# Altium schematic sheet Power Input.SchDoc
size A
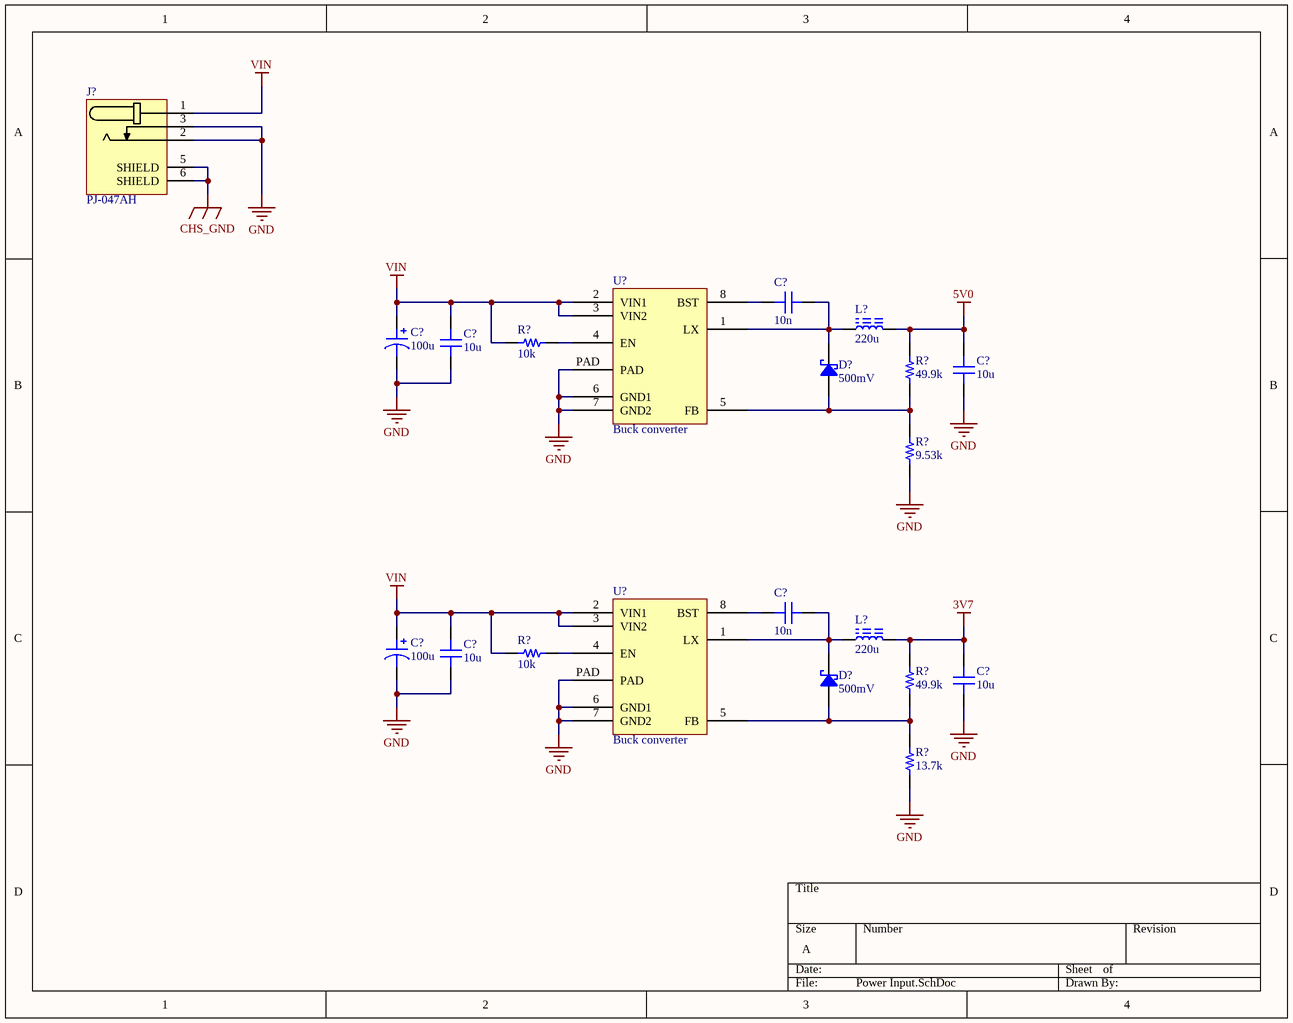
[diagram p0: Power Input.SchDoc]

## Parts
(Parts that share a designator on the sheet are numbered #1, #2 ... from top to bottom, then left to right.)
C?#1  10n  [C0603]
C?#2  100u  [C8x11.5x3.5]
C?#3  10u  [C1206]
C?#4  10u  [C0805]
C?#5  10n  [C0603]
C?#6  100u  [C8x11.5x3.5]
C?#7  10u  [C1206]
C?#8  10u  [C0805]
D?#1  500mV  [SOD-123]
D?#2  500mV  [SOD-123]
J?  PJ-047AH  [PJ-047AH]
L?#1  220u  [L1210]
L?#2  220u  [L1210]
R?#1  10k  [R0201]
R?#2  49.9k  [R0603]
R?#3  9.53k  [R0603]
R?#4  10k  [R0201]
R?#5  49.9k  [R0603]
R?#6  13.7k  [R0603]
U?#1  Buck converter  [AOZ1281DI]
U?#2  Buck converter  [AOZ1281DI]

## Nets
3V7: C?#8.2 L?#2.2 R?#5.2
5V0: C?#4.2 L?#1.2 R?#2.2
CHS_GND: J?.5(SHIELD) J?.6(SHIELD)
GND: C?#2.2 C?#3.1 C?#4.1 C?#6.2 C?#7.1 C?#8.1 J?.2 J?.3 R?#3.1 R?#6.1 U?#1.6(GND1) U?#1.7(GND2) U?#1.PAD U?#2.6(GND1) U?#2.7(GND2) U?#2.PAD
VIN: C?#2.1 C?#3.2 C?#6.1 C?#7.2 J?.1 R?#1.1 R?#4.1 U?#1.2(VIN1) U?#1.3(VIN2) U?#2.2(VIN1) U?#2.3(VIN2)
NetC?#1_1: C?#1.1 D?#1.1 L?#1.1 U?#1.1(LX)
NetC?#1_2: C?#1.2 U?#1.8(BST)
NetC?#5_1: C?#5.1 D?#2.1 L?#2.1 U?#2.1(LX)
NetC?#5_2: C?#5.2 U?#2.8(BST)
NetD?#1_2: D?#1.2 R?#2.1 R?#3.2 U?#1.5(FB)
NetD?#2_2: D?#2.2 R?#5.1 R?#6.2 U?#2.5(FB)
NetR?#1_2: R?#1.2 U?#1.4(EN)
NetR?#4_2: R?#4.2 U?#2.4(EN)

## Library data of the parts
C?#1 C?#5 = 0603YD103KAT2A: Multilayer Ceramic Capacitors MLCC - SMD/SMT 16V .01uF X5R 0603 10% Tol; Manufacturer: Kyocera AVX; Capacitance: 10nF; Supplier 1: Digi-Key; Supplier Part Number 1: 478-0603YD103KAT2ACT-ND; Manufacturer Part Number: 0603YD103KAT2A; RoHS: Yes; Category: Ceramic Capacitors; Stock 1: 31752; Pricing 1: 1=0.10000, 10=0.03300, 50=0.01780, 100=0.01460, 500=0.01040, 1000=0.00817 (USD); Mount: Surface Mount; Case/Package: 0603; Number of Pins: 2; Case Code (Metric): 1608; Case Code (Imperial): 0603; Min Operating Temperature: -55°C; Max Operating Temperature: 85°C; Termination: SMD/SMT; Dielectric: X5R; Tolerance: 10%; Package Quantity: 4000; Voltage Rating: 16V; Packaging: Tape and Reel; Voltage Rating (DC): 16V; Length: 1.6mm; Width: 0.032inch; Height: 0.9mm; Thickness: 0.035inch; Depth: 0.81mm; ComponentLink1URL: http://www.mouser.com/ds/2/40/cx5r-776519.pdf?src-supplier=Mouser; ComponentLink1Description: http://www.mouser.com/ds/2/40/cx5r-776519.pdf?src-supplier=Mouser; ComponentLink2URL: http://datasheets.avx.com/cx5r.pdf?src-supplier=Digi-Key; ComponentLink2Description: http://datasheets.avx.com/cx5r.pdf?src-supplier=Digi-Key; ComponentLink3URL: https://www.avx.com/docs/catalogs/cx5r.pdf?src-supplier=Avnet; ComponentLink3Description: https://www.avx.com/docs/catalogs/cx5r.pdf?src-supplier=Avnet
C?#2 C?#6 = EEU-FM1H101: PANASONIC ELECTRONIC COMPONENTS - EEUFM1H101 - CAP, ALU ELEC, 100UF, 50V, RAD; Ripple Current: 870mA; Tolerance: 20%; Life (Hours): 3000Hour; ESR (Equivalent Series Resistance): 61mR; Polarity: Polar; Dissipation Factor: 0.1%; Lead Diameter: 0.6mm; Supplier 1: Digi-Key; Manufacturer: Panasonic; Manufacturer Part Number: EEU-FM1H101; RoHS: Yes; Category: Aluminum Electrolytic Capacitors; Stock 1: 5906; Pricing 1: 1=0.42000, 10=0.29500, 50=0.20660, 100=0.17700, 500=0.13278, 1000=0.11212, 2500=0.10622, 5000=0.10032 (USD); Mount: Through Hole,PCB; Case/Package: Radial; Contact Plating: Tin; Min Operating Temperature: -40°C; Max Operating Temperature: 105°C; Capacitance: 100uF; Termination: Radial; Packaging: Bulk; Voltage Rating (DC): 50V; Package Quantity: 200; Voltage Rating: 50V; Impedance: 61mR; Voltage: 50V; Diameter: 8mm; Length: 11.5mm; Height: 11.5mm; Lead Pitch: 3.5mm; Height - Seated (Max): 0.512inch; Radiation Hardening: No; Lead Free: Lead Free; REACH SVHC: No SVHC; ComponentLink1URL: https://datasheet.ciiva.com/19479/1985569-19479304.pdf?src-supplier=Jameco; ComponentLink1Description: https://datasheet.ciiva.com/19479/1985569-19479304.pdf?src-supplier=Jameco; ComponentLink2URL: https://datasheet.ciiva.com/11777/0900766b805f3abe-11777837.pdf?src-supplier=RSComponents; ComponentLink2Description: https://datasheet.ciiva.com/11777/0900766b805f3abe-11777837.pdf?src-supplier=RSComponents; ComponentLink3URL: https://datasheet.ciiva.com/43454/1678946-43454655.pdf?src-supplier=Farnell; ComponentLink3Description: https://datasheet.ciiva.com/43454/1678946-43454655.pdf?src-supplier=Farnell; ComponentLink4URL: https://datasheet.ciiva.com/2984/aba0000ce108-2984065.pdf?src-supplier=Avnet; ComponentLink4Description: https://datasheet.ciiva.com/2984/aba0000ce108-2984065.pdf?src-supplier=Avnet; ComponentLink5URL: https://datasheet.ciiva.com/93/aba0000ce108-93030.pdf?src-supplier=Digi-Key; ComponentLink5Description: https://datasheet.ciiva.com/93/aba0000ce108-93030.pdf?src-supplier=Digi-Key; ComponentLink6URL: https://datasheet.ciiva.com/25899/aba0000ce108-25899433.pdf?src-supplier=Avnet+Europe; ComponentLink6Description: https://datasheet.ciiva.com/25899/aba0000ce108-25899433.pdf?src-supplier=Avnet+Europe; ComponentLink7URL: https://datasheet.ciiva.com/30233/aba0000ce108-30233323.pdf?src-supplier=Onlinecomponents.com; ComponentLink7Description: https://datasheet.ciiva.com/30233/aba0000ce108-30233323.pdf?src-supplier=Onlinecomponents.com; ComponentLink8URL: https://datasheet.ciiva.com/18442/70068540-18442844.pdf?src-supplier=Allied+Electronics; ComponentLink8Description: https://datasheet.ciiva.com/18442/70068540-18442844.pdf?src-supplier=Allied+Electronics; ComponentLink9URL: https://datasheet.ciiva.com/3773/41677975s7076861n1386-3773626.pdf?src-supplier=Arrow+Electronics; ComponentLink9Description: https://datasheet.ciiva.com/3773/41677975s7076861n1386-3773626.pdf?src-supplier=Arrow+Electronics; Supplier Part Number 1: P12392-ND
C?#3 C?#7 = CL31A106MBHNNNE: CAP CER 10UF 50V X5R 1206; Manufacturer: Samsung; Tolerance: 20%; Supplier 1: Digi-Key; Manufacturer Part Number: CL31A106MBHNNNE; RoHS: Yes; Category: Ceramic Capacitors; Stock 1: 112342; Pricing 1: 1=0.30000, 10=0.20400, 50=0.13580, 100=0.11550, 500=0.08150, 1000=0.07131 (USD); Mount: Surface Mount; Case/Package: 1206; Case Code (Imperial): 1206; Case Code (Metric): 3216; Min Operating Temperature: -55°C; Max Operating Temperature: 85°C; Dielectric: X5R; Voltage Rating (DC): 50V; Packaging: Tape and Reel; Capacitance: 10uF; Voltage Rating: 50V; Length: 0.126inch; Width: 0.063inch; Thickness: 0.071inch; ComponentLink1URL: http://www.samsungsem.com/kr/support/product-search/mlcc/CL31A106MBHNNNE.jsp?src-supplier=Digi-Key; ComponentLink1Description: http://www.samsungsem.com/kr/support/product-search/mlcc/CL31A106MBHNNNE.jsp?src-supplier=Digi-Key; Supplier Part Number 1: 1276-6736-1-ND
C?#4 C?#8 = CL21A106KOQNNNE: SAMSUNG ELECTRO-MECHANICS - CL21A106KOQNNNE - SMD Multilayer Ceramic Capacitor, 10 µF, 16 V, 0805 [2012 Metric], ± 10%, X5R, CL Series; Capacitance: 10uF; Voltage Rating: 16V; Dielectric: X7R; Supplier 1: Digi-Key; Supplier Part Number 1: 1276-1096-1-ND; Manufacturer: Samsung; Manufacturer Part Number: CL21A106KOQNNNE; RoHS: Yes; Category: Ceramic Capacitors; Stock 1: 1393610; Pricing 1: 1=0.12000, 10=0.09000, 50=0.04900, 100=0.04000, 500=0.02860, 1000=0.02248 (USD); Mount: Surface Mount; Case/Package: 0805; Case Code (Metric): 2012; Case Code (Imperial): 0805; Min Operating Temperature: -55°C; Max Operating Temperature: 85°C; Package Quantity: 1; Packaging: Tape and Reel; Tolerance: 10%; Voltage Rating (DC): 16V; Series: CL; Construction: Flat; Voltage: 16V; Length: 2mm; Width: 0.049inch; Height: 1.25mm; Thickness: 0.055inch; Depth: 1.25mm; Radiation Hardening: No; Lead Free: Lead Free; RoHS Compliant: Yes; ComponentLink1URL: https://datasheet.ciiva.com/15216/getdatasheetpartid-358435-15216234.pdf?src-supplier=Verical; ComponentLink1Description: https://datasheet.ciiva.com/15216/getdatasheetpartid-358435-15216234.pdf?src-supplier=Verical; ComponentLink2URL: https://datasheet.ciiva.com/25798/cl21a106koqnnne-25798133.pdf?src-supplier=Digi-Key; ComponentLink2Description: https://datasheet.ciiva.com/25798/cl21a106koqnnne-25798133.pdf?src-supplier=Digi-Key; ComponentLink3URL: https://datasheet.ciiva.com/16740/cl05b104kq5nnnc-16740697.pdf?src-supplier=Future+Electronics; ComponentLink3Description: https://datasheet.ciiva.com/16740/cl05b104kq5nnnc-16740697.pdf?src-supplier=Future+Electronics
D?#1 D?#2 = MBR230LSTR: Diode Schottky 30V 2A SOD123; Manufacturer: SMC; Supplier 1: Digi-Key; Supplier Part Number 1: 1655-2311-1-ND; Manufacturer Part Number: MBR230LSTR; RoHS: No; Stock 1: 21905; Pricing 1: 1=0.33000, 10=0.22900, 100=0.11180, 500=0.09322, 1000=0.06477 (USD); Mount: Surface Mount; Packaging: Tape and Reel; Max Reverse Voltage (DC): 30V; Average Rectified Current: 2A; ComponentLink1URL: http://www.smc-diodes.com/propdf/MBR230LS%20N1466%20REV.A.pdf?src-supplier=Digi-Key; ComponentLink1Description: http://www.smc-diodes.com/propdf/MBR230LS%20N1466%20REV.A.pdf?src-supplier=Digi-Key
J? = PJ-047AH: CONN PWR JACK 2.1X5.5MM SOLDER; Manufacturer: CUI; Gender: Male; Shielding: Shielded; Current Rating: 5A; Number of Conductors: 2; Voltage Rating: 24V; Insulation Resistance: 100MR; Supplier 1: Digi-Key; Supplier Part Number 1: CP-047AH-ND; Manufacturer Part Number: PJ-047AH; RoHS: Yes; Category: Connectors; Stock 1: 4559; Pricing 1: 1=0.80000, 10=0.70100, 25=0.66000, 50=0.63260, 100=0.60500, 250=0.55000, 500=0.49500, 1000=0.44000, 2500=0.39875 (USD); Mount: Through Hole; Color: Black; Contact Material: Copper,Brass; Contact Plating: Nickel; Housing Color: Black; Housing Material: Thermoplastic; Min Operating Temperature: -25°C; Max Operating Temperature: 85°C; Termination: Solder; Connector Type: Jack; Package Quantity: 500; Contact Gender: Male; Orientation: Horizontal; Series: -; Lead Free: Lead Free; Flammability Rating: UL94 V-0; RoHS Compliant: Yes; ComponentLink1URL: http://www.mouser.com/ds/2/670/PJ-047AH-524157.pdf?src-supplier=Mouser; ComponentLink1Description: http://www.mouser.com/ds/2/670/PJ-047AH-524157.pdf?src-supplier=Mouser; ComponentLink2URL: https://www.cui.com/product/resource/digikeypdf/pj-047ah.pdf?src-supplier=Digi-Key; ComponentLink2Description: https://www.cui.com/product/resource/digikeypdf/pj-047ah.pdf?src-supplier=Digi-Key
L?#1 L?#2 = SRR1210-221M: Inductor Power Shielded Wirewound 220uH 20% 1KHz 15Q-Factor Ferrite 1.7A 315mOhm DCR T/R; Manufacturer: Bourns; DC Resistance (DCR): 315mR; Q Factor: 15; Self Resonant Frequency: 1.8MHz; Saturation Current: 1.5A; Test Frequency: 100kHz; Current: 8.5A; Supplier 1: Digi-Key; Supplier Part Number 1: SRR1210-221MCT-ND; Manufacturer Part Number: SRR1210-221M; RoHS: Yes; Category: Fixed Inductors; Stock 1: 7209; Pricing 1: 1=1.27000, 10=1.18000, 25=1.08920, 50=0.90760, 100=0.85310 (USD); Mount: Surface Mount; Case/Package: Nonstandard; Core Material: Ferrite; Weight: 0.169315oz; Min Operating Temperature: -40°C; Max Operating Temperature: 125°C; Tolerance: 20%; Inductance: 220uH; Max DC Current: 1.7A; Shielding: Shielded; Packaging: Tape and Reel; Package Quantity: 250; Current Rating: 1.7A; Resistor Type: Wirewound; Termination: SMD/SMT; DC Current: 1.7A; Inductance Tolerance: 20%; RMS Current (Irms): 1.7A; Length: 12mm; Width: 0.472inch; Height: 10mm; Height - Seated (Max): 0.394inch; Depth: 12.5mm; Military Standard: Not; REACH SVHC: No SVHC; ComponentLink1URL: https://datasheet.ciiva.com/11802/0900766b80f2b72a-11802937.pdf?src-supplier=RSComponents; ComponentLink1Description: https://datasheet.ciiva.com/11802/0900766b80f2b72a-11802937.pdf?src-supplier=RSComponents; ComponentLink2URL: https://datasheet.ciiva.com/4955/srr1210-60886-4955655.pdf?src-supplier=Mouser; ComponentLink2Description: https://datasheet.ciiva.com/4955/srr1210-60886-4955655.pdf?src-supplier=Mouser; ComponentLink3URL: https://datasheet.ciiva.com/6704/srr1210-6704183.pdf?src-supplier=Digi-Key; ComponentLink3Description: https://datasheet.ciiva.com/6704/srr1210-6704183.pdf?src-supplier=Digi-Key; ComponentLink4URL: https://datasheet.ciiva.com/6704/srr1210-6704184.pdf?src-supplier=Digi-Key; ComponentLink4Description: https://datasheet.ciiva.com/6704/srr1210-6704184.pdf?src-supplier=Digi-Key; ComponentLink5URL: https://datasheet.ciiva.com/6704/srr1210-6704185.pdf?src-supplier=Digi-Key; ComponentLink5Description: https://datasheet.ciiva.com/6704/srr1210-6704185.pdf?src-supplier=Digi-Key; ComponentLink6URL: https://datasheet.ciiva.com/17111/70277039-17111754.pdf?src-supplier=Allied+Electronics; ComponentLink6Description: https://datasheet.ciiva.com/17111/70277039-17111754.pdf?src-supplier=Allied+Electronics; ComponentLink7URL: https://datasheet.ciiva.com/48684/srr1210-48684604.pdf?src-supplier=Avnet; ComponentLink7Description: https://datasheet.ciiva.com/48684/srr1210-48684604.pdf?src-supplier=Avnet
R?#1 R?#4 = RMCF0201FT10K0: RES 10K OHM 1% 1/20W 0201; Manufacturer: Stackpole Electronics; Max Power Dissipation: 50mW; Temperature Coefficient: 200ppm/°C; Resistance: 10kR; Supplier 1: Digi-Key; Manufacturer Part Number: RMCF0201FT10K0; RoHS: Yes; Category: Chip SMD Resistors; Stock 1: 1526173; Pricing 1: 1=0.10000, 10=0.02300, 100=0.00940, 1000=0.00424, 2500=0.00368, 5000=0.00304 (USD); Mount: Surface Mount; Case/Package: 0201; Contact Plating: Tin,Matte; Case Code (Imperial): 0201; Case Code (Metric): 0603; Min Operating Temperature: -55°C; Max Operating Temperature: 125°C; Resistor Type: Thick Film; Number of Terminations: 2; Packaging: Tape and Reel; Tolerance: 1%; Power Rating: 50mW; Length: 0.024inch; Width: 0.012inch; Height: 0.009inch; ComponentLink1URL: https://www.seielect.com/catalog/SEI-Packaging.pdf?src-supplier=Digi-Key; ComponentLink1Description: https://www.seielect.com/catalog/SEI-Packaging.pdf?src-supplier=Digi-Key; ComponentLink2URL: https://www.seielect.com/Catalog/SEI-RMCF_RMCP.pdf?src-supplier=Avnet+Asia; ComponentLink2Description: https://www.seielect.com/Catalog/SEI-RMCF_RMCP.pdf?src-supplier=Avnet+Asia; ComponentLink3URL: https://www.seielect.com/Catalog/SEI-RMCF_RMCP.pdf?src-supplier=Avnet; ComponentLink3Description: https://www.seielect.com/Catalog/SEI-RMCF_RMCP.pdf?src-supplier=Avnet; ComponentLink4URL: https://www.seielect.com/Catalog/SEI-RMCF_RMCP.pdf?src-supplier=Digi-Key; ComponentLink4Description: https://www.seielect.com/Catalog/SEI-RMCF_RMCP.pdf?src-supplier=Digi-Key; Supplier Part Number 1: RMCF0201FT10K0CT-ND
R?#2 R?#5 = ERA-3AEB4992V: RES SMD 49.9KOHM 0.1% 1/10W 0603; Manufacturer: Panasonic; Resistance: 49.9kR; Temperature Coefficient: 25ppm/°C; Power Rating: 100mW; Voltage Rating: 75V; Supplier 1: Digi-Key; Manufacturer Part Number: ERA-3AEB4992V; RoHS: Yes; Category: Chip SMD Resistors; Stock 1: 25051; Pricing 1: 1=0.31000, 10=0.26000, 100=0.10150, 1000=0.04248, 2500=0.03894 (USD); Mount: Surface Mount; Case/Package: 0603; Number of Pins: 2; Contact Plating: Tin; Case Code (Metric): 1608; Case Code (Imperial): 0603; Min Operating Temperature: -55°C; Max Operating Temperature: 155°C; Tolerance: 0.1%; Resistor Type: Thin Film,Metal Film; Packaging: Tape and Reel; Package Quantity: 1; Number of Terminations: 2; Termination: SMD/SMT; Max Power Dissipation: 100mW; Voltage Rating (DC): 75V; Features: Automotive AEC-Q200; Length: 1.6mm; Width: 0.8mm; Height: 0.45mm; Depth: 0.8mm; Radiation Hardening: No; REACH SVHC: No SVHC; Military Standard: Not; Lead Free: Lead Free; ComponentLink1URL: https://datasheet.ciiva.com/11812/0900766b80eb1d8c-11812018.pdf?src-supplier=RSComponents; ComponentLink1Description: https://datasheet.ciiva.com/11812/0900766b80eb1d8c-11812018.pdf?src-supplier=RSComponents; ComponentLink2URL: https://datasheet.ciiva.com/29183/451874-da-01-en-widerstand-0603-era-29183904.pdf?src-supplier=Conrad; ComponentLink2Description: https://datasheet.ciiva.com/29183/451874-da-01-en-widerstand-0603-era-29183904.pdf?src-supplier=Conrad; ComponentLink3URL: https://datasheet.ciiva.com/5998/485442-5998330.pdf?src-supplier=Farnell; ComponentLink3Description: https://datasheet.ciiva.com/5998/485442-5998330.pdf?src-supplier=Farnell; ComponentLink4URL: https://datasheet.ciiva.com/7861/485442-7861691.pdf?src-supplier=Element14; ComponentLink4Description: https://datasheet.ciiva.com/7861/485442-7861691.pdf?src-supplier=Element14; ComponentLink5URL: https://datasheet.ciiva.com/5998/485442-5998334.pdf?src-supplier=Farnell; ComponentLink5Description: https://datasheet.ciiva.com/5998/485442-5998334.pdf?src-supplier=Farnell; ComponentLink6URL: https://datasheet.ciiva.com/30157/54aoa0000ce26-30157031.pdf?src-supplier=Onlinecomponents.com; ComponentLink6Description: https://datasheet.ciiva.com/30157/54aoa0000ce26-30157031.pdf?src-supplier=Onlinecomponents.com; ComponentLink7URL: https://datasheet.ciiva.com/5998/485442-5998332.pdf?src-supplier=Farnell; ComponentLink7Description: https://datasheet.ciiva.com/5998/485442-5998332.pdf?src-supplier=Farnell; ComponentLink8URL: https://datasheet.ciiva.com/46422/485442-46422700.pdf?src-supplier=Element14; ComponentLink8Description: https://datasheet.ciiva.com/46422/485442-46422700.pdf?src-supplier=Element14; Supplier Part Number 1: P49.9KDBCT-ND
R?#3 = ERA-3AEB9531V: RES SMD 9.53KOHM 0.1% 1/10W 0603; Manufacturer: Panasonic; Temperature Coefficient: 25ppm/°C; Resistance: 9.53kR; Voltage Rating (DC): 75V; Power Rating: 100mW; Supplier 1: Digi-Key; Manufacturer Part Number: ERA-3AEB9531V; RoHS: Yes; Category: Chip SMD Resistors; Stock 1: 27415; Pricing 1: 1=0.31000, 10=0.26000, 100=0.10150, 1000=0.04248, 2500=0.03894 (USD); Mount: Surface Mount; Case/Package: 0603; Number of Pins: 2; Contact Plating: Tin; Case Code (Imperial): 0603; Case Code (Metric): 1608; Min Operating Temperature: -55°C; Max Operating Temperature: 155°C; Resistor Type: Metal Film,Thin Film; Tolerance: 0.1%; Number of Terminations: 2; Features: Automotive AEC-Q200; Voltage Rating: 75V; Package Quantity: 5000; Packaging: Tape and Reel; Max Power Dissipation: 100mW; Length: 1.6mm; Width: 0.8mm; Height: 0.45mm; Depth: 0.8mm; Radiation Hardening: No; Military Standard: Not; Lead Free: Lead Free; ComponentLink1URL: https://datasheet.ciiva.com/11811/0900766b80eb1d8c-11811912.pdf?src-supplier=RSComponents; ComponentLink1Description: https://datasheet.ciiva.com/11811/0900766b80eb1d8c-11811912.pdf?src-supplier=RSComponents; ComponentLink2URL: https://datasheet.ciiva.com/29184/452443-da-01-en-widerstand-0603-era-29184006.pdf?src-supplier=Conrad; ComponentLink2Description: https://datasheet.ciiva.com/29184/452443-da-01-en-widerstand-0603-era-29184006.pdf?src-supplier=Conrad; ComponentLink3URL: https://datasheet.ciiva.com/5987/485442-5987161.pdf?src-supplier=Farnell; ComponentLink3Description: https://datasheet.ciiva.com/5987/485442-5987161.pdf?src-supplier=Farnell; ComponentLink4URL: https://datasheet.ciiva.com/7829/485442-7829102.pdf?src-supplier=Element14; ComponentLink4Description: https://datasheet.ciiva.com/7829/485442-7829102.pdf?src-supplier=Element14; ComponentLink5URL: https://datasheet.ciiva.com/9194/aoa0000ce26-9194167.pdf?src-supplier=Avnet; ComponentLink5Description: https://datasheet.ciiva.com/9194/aoa0000ce26-9194167.pdf?src-supplier=Avnet; ComponentLink6URL: https://datasheet.ciiva.com/5987/485442-5987164.pdf?src-supplier=Farnell; ComponentLink6Description: https://datasheet.ciiva.com/5987/485442-5987164.pdf?src-supplier=Farnell; ComponentLink7URL: https://datasheet.ciiva.com/5987/485442-5987166.pdf?src-supplier=Farnell; ComponentLink7Description: https://datasheet.ciiva.com/5987/485442-5987166.pdf?src-supplier=Farnell; Supplier Part Number 1: P9.53KDBCT-ND
R?#6 = ERJ-PB3B1372V: RES SMD 13.7K OHM 0.1% 1/5W 0603; Manufacturer: Panasonic; Max Power Dissipation: 200mW; Temperature Coefficient: 50ppm/°C; Resistance: 13.7kR; Supplier 1: Digi-Key; Manufacturer Part Number: ERJ-PB3B1372V; RoHS: Yes; Category: Chip SMD Resistors; Stock 1: 5380; Pricing 1: 1=0.23000, 10=0.19100, 25=0.13920, 50=0.10100, 100=0.07480, 250=0.05744, 500=0.04524, 1000=0.03132 (USD); Case/Package: 0603; Case Code (Imperial): 0603; Case Code (Metric): 1608; Min Operating Temperature: -55°C; Max Operating Temperature: 155°C; Features: Automotive AEC-Q200; Tolerance: 0.1%; Packaging: Tape and Reel; Resistor Type: Thick Film; Number of Terminations: 2; Length: 0.063inch; Width: 0.032inch; Height - Seated (Max): 0.022inch; ComponentLink1URL: https://industrial.panasonic.com/cdbs/www-data/pdf/RDM0000/DMM0000COL5.pdf?src-supplier=Digi-Key; ComponentLink1Description: https://industrial.panasonic.com/cdbs/www-data/pdf/RDM0000/DMM0000COL5.pdf?src-supplier=Digi-Key; ComponentLink2URL: https://industrial.panasonic.com/sa/system/files/data/download/catalog/id_fixed-resistors_e_2.pdf?src-supplier=Digi-Key; ComponentLink2Description: https://industrial.panasonic.com/sa/system/files/data/download/catalog/id_fixed-resistors_e_2.pdf?src-supplier=Digi-Key; Supplier Part Number 1: P20100CT-ND
U?#1 U?#2 = AOZ1281DI: Conv DC-DC 3V to 26V Step Down Single-Out 0.8V to 22.1V 1.8A 8-Pin DFN EP T/R; Manufacturer: Alpha & Omega Semiconductor; Number of Outputs: 1; Efficiency: 95%; Min Output Voltage: 800mV; Switching Frequency: 1.5MHz; Synchronous Rectifier: No; Output Type: Adjustable; Output Configuration: Positive; Supplier 1: Digi-Key; Supplier Part Number 1: 785-1276-1-ND; Manufacturer Part Number: AOZ1281DI; RoHS: Yes; Category: Voltage Regulators - Switching; Stock 1: 15925; Pricing 1: 1=0.81000, 10=0.71400, 25=0.67040, 100=0.50820, 250=0.43248, 500=0.41086, 1000=0.31355 (USD); Mount: Surface Mount; Case/Package: DFN; Number of Pins: 8; Min Operating Temperature: -40°C; Max Operating Temperature: 85°C; Output Current: 1.8A; Packaging: Tape and Reel; Min Input Voltage: 3V; Max Input Voltage: 26V; Max Output Voltage: 22.1V; Series: EZBuck™; RoHS Compliant: Yes; ComponentLink1URL: https://datasheet.ciiva.com/2028/aoz1281di-2028092.pdf?src-supplier=Digi-Key; ComponentLink1Description: https://datasheet.ciiva.com/2028/aoz1281di-2028092.pdf?src-supplier=Digi-Key; ComponentLink2URL: https://datasheet.ciiva.com/2028/aoz1281di-2028093.pdf?src-supplier=Digi-Key; ComponentLink2Description: https://datasheet.ciiva.com/2028/aoz1281di-2028093.pdf?src-supplier=Digi-Key; ComponentLink3URL: https://datasheet.ciiva.com/2028/aoz1281di-2028094.pdf?src-supplier=Digi-Key; ComponentLink3Description: https://datasheet.ciiva.com/2028/aoz1281di-2028094.pdf?src-supplier=Digi-Key